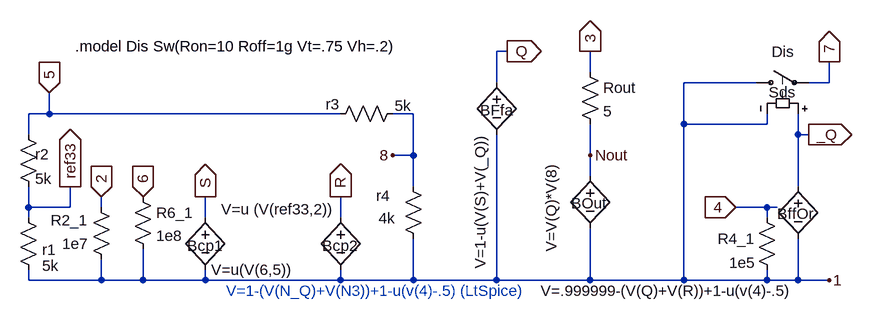
[diagram p0: schematic 5B1Sw555.asc]
5B1Sw555.asc, the LTspice schematic file:
Version 4
SHEET 1 1356 916
WIRE 224 272 208 272
WIRE 352 304 352 272
WIRE 208 320 208 272
WIRE 608 320 496 320
WIRE 720 320 720 288
WIRE 720 320 688 320
WIRE -480 368 -480 336
WIRE -480 368 -512 368
WIRE -32 368 -480 368
WIRE 80 368 48 368
WIRE 496 384 496 320
WIRE 624 384 624 368
WIRE 624 384 496 384
WIRE -512 400 -512 368
WIRE 672 400 672 368
WIRE 688 400 672 400
WIRE 80 432 80 368
WIRE 80 432 48 432
WIRE 352 432 352 384
WIRE 352 464 352 432
WIRE 80 480 80 432
WIRE 672 480 672 400
WIRE -512 512 -512 480
WIRE -448 512 -448 480
WIRE -448 512 -512 512
WIRE -400 512 -400 496
WIRE 624 512 576 512
WIRE 640 512 624 512
WIRE -512 528 -512 512
WIRE -240 528 -240 496
WIRE -32 528 -32 496
WIRE 624 528 624 512
WIRE -512 624 -512 608
WIRE -400 624 -400 592
WIRE -400 624 -512 624
WIRE -336 624 -336 576
WIRE -336 624 -400 624
WIRE -240 624 -240 608
WIRE -240 624 -336 624
WIRE -32 624 -32 608
WIRE -32 624 -240 624
WIRE 80 624 80 560
WIRE 80 624 -32 624
WIRE 208 624 208 400
WIRE 208 624 80 624
WIRE 352 624 352 544
WIRE 352 624 208 624
WIRE 496 624 496 384
WIRE 496 624 352 624
WIRE 624 624 624 608
WIRE 624 624 496 624
WIRE 672 624 672 560
WIRE 672 624 624 624
WIRE 720 624 672 624
FLAG -448 480 ref33
IOPIN -448 480 Out
FLAG -480 336 5
IOPIN -480 336 In
FLAG 720 288 7
IOPIN 720 288 Out
FLAG 48 432 8
FLAG 352 272 3
IOPIN 352 272 Out
FLAG 720 624 1
FLAG 576 512 4
IOPIN 576 512 In
FLAG -336 496 6
IOPIN -336 496 In
FLAG -240 496 S
IOPIN -240 496 Out
FLAG -400 496 2
IOPIN -400 496 In
FLAG -32 496 R
IOPIN -32 496 Out
FLAG 224 272 Q
IOPIN 224 272 Out
FLAG 688 400 _Q
IOPIN 688 400 Out
FLAG 352 432 Nout
SYMBOL res -528 512 R0
WINDOW 0 37 65 Left 2
WINDOW 3 37 90 Left 2
SYMATTR InstName r1
SYMATTR Value 5k
SYMBOL res -528 384 R0
WINDOW 0 26 46 Left 2
WINDOW 3 26 84 Left 2
SYMATTR InstName r2
SYMATTR Value 5k
SYMBOL res -48 384 R270
WINDOW 0 15 4 VTop 2
WINDOW 3 44 112 VBottom 2
SYMATTR InstName r3
SYMATTR Value 5k
SYMBOL sw 592 320 R270
WINDOW 0 -15 35 VRight 2
WINDOW 3 47 39 VRight 2
SYMATTR InstName Sds
SYMATTR Value Dis
SYMBOL res 64 464 R0
WINDOW 0 -41 30 Left 2
WINDOW 3 -37 65 Left 2
SYMATTR InstName r4
SYMATTR Value 4k
SYMBOL res -384 608 R180
WINDOW 0 36 76 Left 2
WINDOW 3 36 40 Left 2
SYMATTR InstName R2_1
SYMATTR Value 1e7
SYMBOL bv -240 512 R0
WINDOW 0 -28 59 Left 2
WINDOW 3 135 96 Right 2
SYMATTR InstName Bcp1
SYMATTR Value V=u(V(6,5))
SYMBOL bv -32 512 R0
WINDOW 0 -28 59 Left 2
WINDOW 3 -184 3 Left 2
SYMATTR InstName Bcp2
SYMATTR Value V=u (V(ref33,2))
SYMBOL bv 208 304 R0
WINDOW 0 -25 59 Left 2
WINDOW 3 -25 94 VRight 2
SYMATTR InstName BFfa
SYMATTR Value V=1-u(V(S)+V(_Q))
SYMBOL res -352 480 R0
SYMATTR InstName R6_1
SYMATTR Value 1e8
SYMBOL bv 672 464 R0
WINDOW 0 -32 58 Left 2
WINDOW 3 -396 176 Left 2
SYMATTR InstName BffOr
SYMATTR Value V=.999999-(V(Q)+V(R))+1-u(v(4)-.5)
SYMBOL bv 352 448 R0
WINDOW 0 -29 58 Left 2
WINDOW 3 -60 -3 VRight 2
SYMATTR InstName BOut
SYMATTR Value V=V(Q)*V(8)
SYMBOL res 336 288 R0
SYMATTR InstName Rout
SYMATTR Value 5
SYMBOL res 608 512 R0
WINDOW 0 -60 48 Left 2
WINDOW 3 -42 85 Left 2
SYMATTR InstName R4_1
SYMATTR Value 1e5
TEXT -440 264 Left 2 !.model Dis Sw(Ron=10 Roff=1g Vt=.75 Vh=.2)
TEXT -208 640 Left 2 ;V=1-(V(N_Q)+V(N3))+1-u(v(4)-.5) (LtSpice)

The netlist it stands for:
* 5B1Sw555.asc
r1 ref33 1 5k
r2 5 ref33 5k
r3 5 8 5k
Sds 1 7 _Q 1 Dis
r4 8 1 4k
R2_1 1 2 1e7
Bcp1 S 1 V=u(V(6,5))
Bcp2 R 1 V=u (V(ref33,2))
BFfa Q 1 V=1-u(V(S)+V(_Q))
R6_1 6 1 1e8
BffOr _Q 1 V=.999999-(V(Q)+V(R))+1-u(v(4)-.5)
BOut Nout 1 V=V(Q)*V(8)
Rout 3 Nout 5
R4_1 4 1 1e5
.model Dis Sw(Ron=10 Roff=1g Vt=.75 Vh=.2)
* V=1-(V(N_Q)+V(N3))+1-u(v(4)-.5) (LtSpice)
.backanno
.end